# EAGLE design BarGraphDriver (EAGLE 7.5.0)
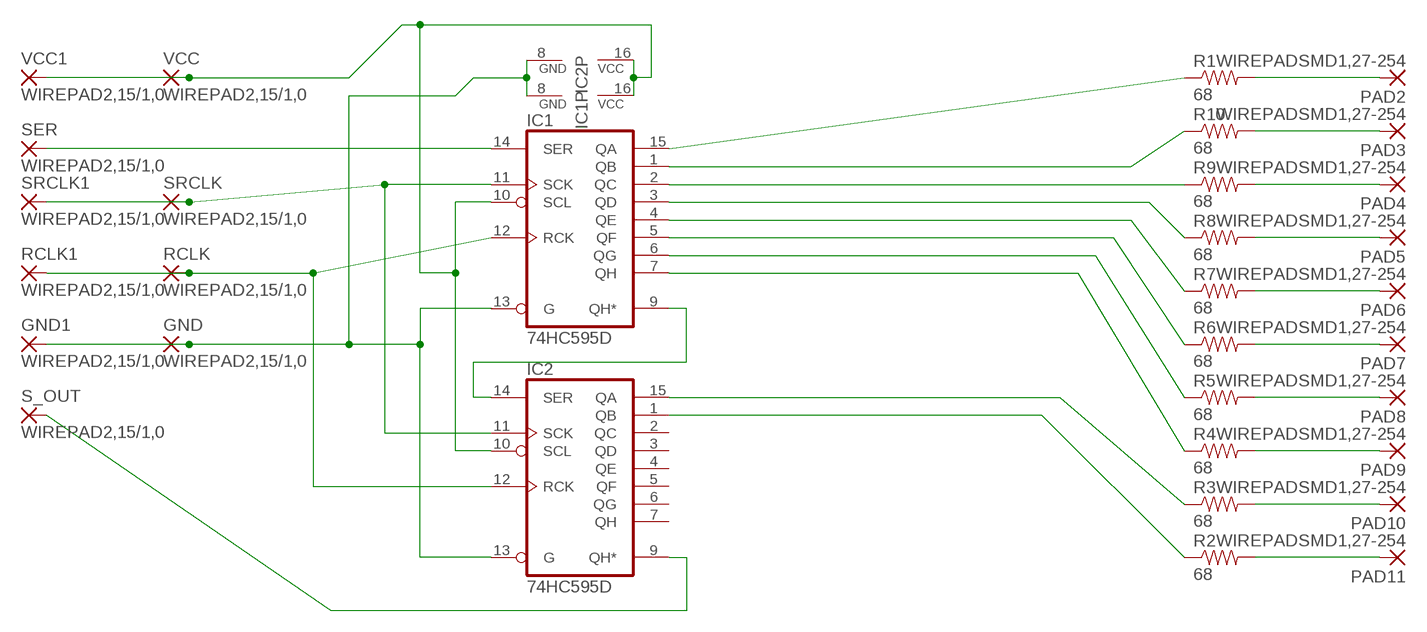
[diagram p0: schematic, sheet 1]

## Parts
GND  WIREPAD2,15/1,0  [2,15/1,0]
GND1  WIREPAD2,15/1,0  [2,15/1,0]
IC1  74HC595D  [SO16]
IC2  74HC595D  [SO16]
PAD2  WIREPADSMD1,27-254  [SMD1,27-2,54]
PAD3  WIREPADSMD1,27-254  [SMD1,27-2,54]
PAD4  WIREPADSMD1,27-254  [SMD1,27-2,54]
PAD5  WIREPADSMD1,27-254  [SMD1,27-2,54]
PAD6  WIREPADSMD1,27-254  [SMD1,27-2,54]
PAD7  WIREPADSMD1,27-254  [SMD1,27-2,54]
PAD8  WIREPADSMD1,27-254  [SMD1,27-2,54]
PAD9  WIREPADSMD1,27-254  [SMD1,27-2,54]
PAD10  WIREPADSMD1,27-254  [SMD1,27-2,54]
PAD11  WIREPADSMD1,27-254  [SMD1,27-2,54]
R1  68  RESISTOR1206  [1206]
R2  68  RESISTOR1206  [1206]
R3  68  RESISTOR1206  [1206]
R4  68  RESISTOR1206  [1206]
R5  68  RESISTOR1206  [1206]
R6  68  RESISTOR1206  [1206]
R7  68  RESISTOR1206  [1206]
R8  68  RESISTOR1206  [1206]
R9  68  RESISTOR1206  [1206]
R10  68  RESISTOR1206  [1206]
RCLK  WIREPAD2,15/1,0  [2,15/1,0]
RCLK1  WIREPAD2,15/1,0  [2,15/1,0]
S_OUT  WIREPAD2,15/1,0  [2,15/1,0]
SER  WIREPAD2,15/1,0  [2,15/1,0]
SRCLK  WIREPAD2,15/1,0  [2,15/1,0]
SRCLK1  WIREPAD2,15/1,0  [2,15/1,0]
VCC  WIREPAD2,15/1,0  [2,15/1,0]
VCC1  WIREPAD2,15/1,0  [2,15/1,0]

## Nets
GND [GND]: GND1.1(P) GND.1(P) IC1.8(GND) IC1.13(G) IC2.8(GND) IC2.13(G)
N$1 [LED]: PAD11.1(P) R2.2
N$2 [LED]: PAD10.1(P) R3.2
N$3 [LED]: PAD9.1(P) R4.2
N$4 [LED]: PAD8.1(P) R5.2
N$5 [LED]: PAD7.1(P) R6.2
N$6 [LED]: PAD6.1(P) R7.2
N$7 [LED]: PAD5.1(P) R8.2
N$8 [LED]: PAD4.1(P) R9.2
N$9 [LED]: PAD3.1(P) R10.2
N$10 [LED]: PAD2.1(P) R1.2
N$11 [LED]: IC1.15(QA) R1.1
N$12 [LED]: IC1.1(QB) R10.1
N$13 [LED]: IC1.2(QC) R9.1
N$14 [LED]: IC1.3(QD) R8.1
N$15 [LED]: IC1.4(QE) R7.1
N$16 [LED]: IC1.5(QF) R6.1
N$17 [LED]: IC1.6(QG) R5.1
N$18 [LED]: IC1.7(QH) R4.1
N$19 [LED]: IC2.15(QA) R3.1
N$20 [LED]: IC2.1(QB) R2.1
N$22: IC1.9(QH*) IC2.14(SER)
RCLK: IC1.12(RCK) IC2.12(RCK) RCLK1.1(P) RCLK.1(P)
S_OUT: IC2.9(QH*) S_OUT.1(P)
SER: IC1.14(SER) SER.1(P)
SRCLK: IC1.11(SCK) IC2.11(SCK) SRCLK1.1(P) SRCLK.1(P)
VCC [VCC]: IC1.10(SCL) IC1.16(VCC) IC2.10(SCL) IC2.16(VCC) VCC1.1(P) VCC.1(P)
Unconnected: IC2.2(QC) IC2.3(QD) IC2.4(QE) IC2.5(QF) IC2.6(QG) IC2.7(QH)

## Library data of the parts
GND GND1 PAD2-PAD11 RCLK RCLK1 S_OUT SER SRCLK SRCLK1 = wirepad:WIREPAD: Wire PAD connect wire on PCB
IC1 IC2 = 74xx-eu:74*595: 8-bit SHIFT REGISTER, output latch
R1-R10 = SparkFun-Resistors:RESISTOR: Resistor Basic schematic elements and footprints for 0603, 1206, and PTH resistors.
VCC VCC1 = smallWirepadSquare:WIREPAD: Wire PAD connect wire on PCB

## Net classes
0 default: width 0.406 mm, drill 0.381 mm, clearance 0.305 mm
1 VCC: width 0.406 mm, drill 0.381 mm, clearance 0.305 mm
2 LED: width 0.406 mm, drill 0.381 mm, clearance 0.305 mm
3 GND: width 0.406 mm, drill 0.381 mm, clearance 0.305 mm

## Board
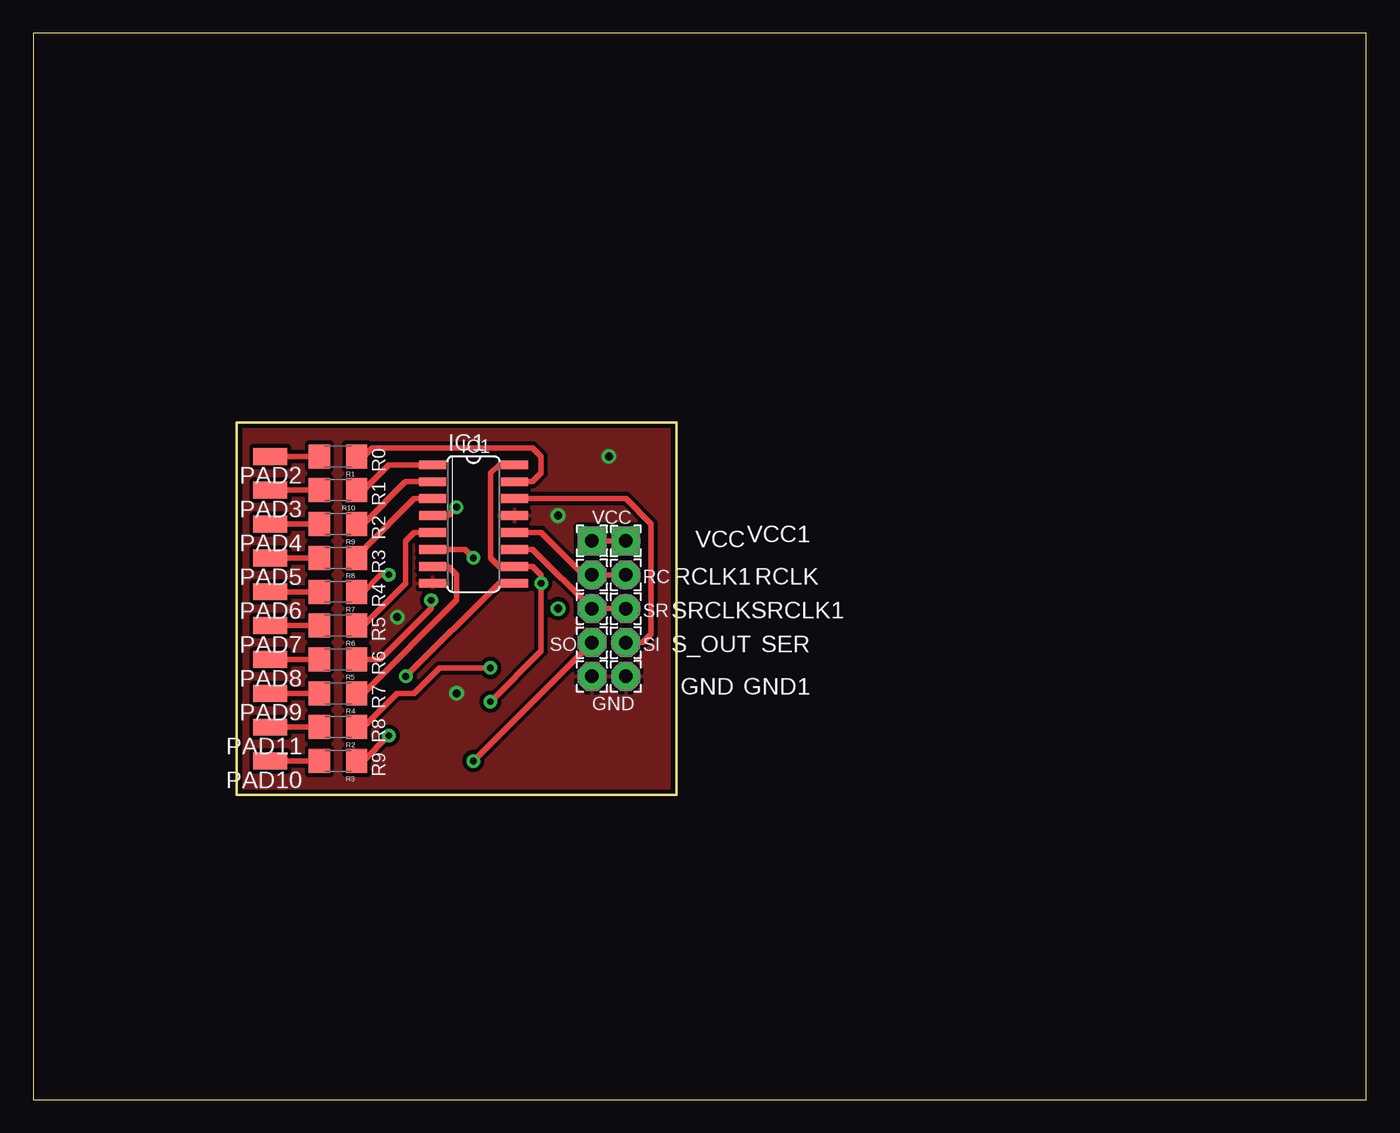
[diagram p1: board, top side]
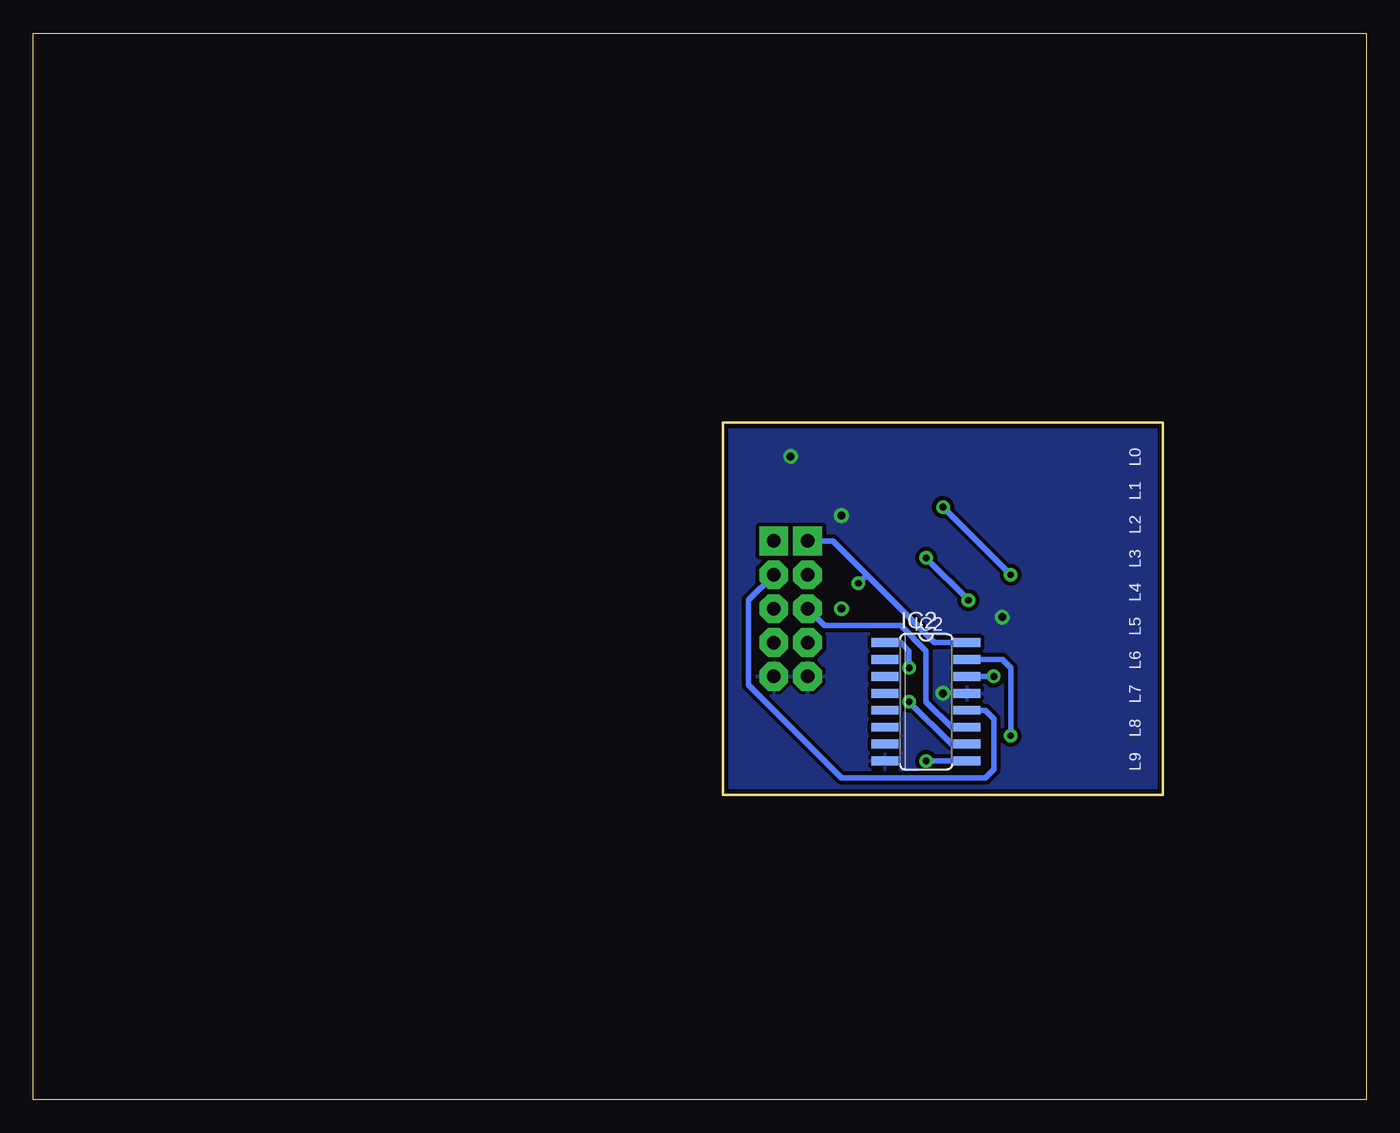
[diagram p2: board, bottom side, seen from below]

Size 100 x 80 mm. Coordinates in mm from the lower left corner, seen from the top.
Outline: 0,0 100,0 100,80 0,80 0,0
Outline: 15.24,50.8 15.24,22.86 48.26,22.86 48.26,50.8 15.24,50.8
Copper layers (1*16): Top 0.035mm / dielectric 1.5mm / Bottom 0.035mm
Design rules "SparkFun-2-layer-STANDARD": minimum track width 10mil, minimum drill 20mil, track to track 10mil, track to pad 8mil, pad to pad 8mil, via to via 10mil, smd to smd 8mil, copper to edge 8mil, drill to drill 8mil, minimum pad ring 10mil, minimum via ring 10mil, stop-mask expansion 4mil, vias tented up to drill 25mil, thermal gap 10mil

### Footprints (pad centres in the part's own frame; a part is rotated, then mirrored left to right if it is on the bottom)
2,15/1,0 = drill 1.016 pad 2.159 octagon: 1 0,0
SO16 = smd 0.66 x 2.032: 1 -4.445,-3.073; 2 -3.175,-3.073; 3 -1.905,-3.073; 4 -0.635,-3.073; 5 0.635,-3.073; 6 1.905,-3.073; 7 3.175,-3.073; 8 4.445,-3.073; 9 4.445,3.073; 10 3.175,3.073; 11 1.905,3.073; 12 0.635,3.073; 13 -0.635,3.073; 14 -1.905,3.073; 15 -3.175,3.073; 16 -4.445,3.073
SMD1,27-2,54 = smd 1.27 x 2.54: 1 0,0
1206 = smd 1.6 x 1.8: 1 -1.4,0; 2 1.4,0
2,15/1,0' = drill 1.016 pad 2.159 square: 1 0,0

### Placement (x,y rotation side)
GND  41.91,31.75 180 top
GND1  44.45,31.75 180 top
IC1  33.02,43.18 270 top
IC2  33.02,29.84 270 bottom
PAD2  17.78,48.26 90 top
PAD3  17.78,45.72 90 top
PAD4  17.78,43.18 90 top
PAD5  17.78,40.64 90 top
PAD6  17.78,38.1 90 top
PAD7  17.78,35.56 90 top
PAD8  17.78,33.02 90 top
PAD9  17.78,30.48 90 top
PAD10  17.78,25.4 90 top
PAD11  17.78,27.94 90 top
R1  22.86,48.26 180 top
R2  22.86,27.94 180 top
R3  22.86,25.4 180 top
R4  22.86,30.48 180 top
R5  22.86,33.02 180 top
R6  22.86,35.56 180 top
R7  22.86,38.1 180 top
R8  22.86,40.64 180 top
R9  22.86,43.18 180 top
R10  22.86,45.72 180 top
RCLK  44.45,39.37 180 top
RCLK1  41.91,39.37 180 top
S_OUT  41.91,34.29 180 top
SER  44.45,34.29 180 top
SRCLK  41.91,36.83 180 top
SRCLK1  44.45,36.83 180 top
VCC  WIREPAD2,15/1,0  [2,15/1,0']  41.91,41.91 0 top
VCC1  WIREPAD2,15/1,0  [2,15/1,0']  44.45,41.91 180 top

### Tracks (layer width: path | path; a pad name or v marks a point on that pad's centre or on a via)
GND  (via drill 0.6)
  other vias: 43.18,48.26 31.75,30.48 39.37,43.81 27.3,36.2
  pour Top (isolate 0.305): 15.24,50.8 15.24,22.86 48.26,22.86 48.26,50.8
  pour Bottom (isolate 0.305): 15.24,50.8 15.24,22.86 48.26,22.86 48.26,50.8
N$1
  Top 0.406: PAD11.1 R2.2
N$2
  Top 0.406: PAD10.1 R3.2
N$3
  Top 0.406: PAD9.1 R4.2
N$4
  Top 0.406: PAD8.1 R5.2
N$5
  Top 0.406: PAD7.1 R6.2
N$6
  Top 0.406: PAD6.1 R7.2
N$7
  Top 0.406: PAD5.1 R8.2
N$8
  Top 0.406: PAD4.1 R9.2
N$9
  Top 0.406: PAD3.1 R10.2
N$10
  Top 0.406: PAD2.1 R1.2
N$11
  Top 0.406: R1.1 24.77,48.26 25.4,48.9 37.47,48.9 38.1,48.26 38.1,46.99 37.47,46.35 IC1.15
N$12
  Top 0.406: IC1.1 26.67,47.62 24.77,45.72 R10.1
N$13
  Top 0.406: IC1.2 27.94,46.35 24.77,43.18 R9.1
N$14
  Top 0.406: R8.1 24.77,40.64 24.77,41.27 28.57,45.09 IC1.3
N$15  (via drill 0.51)
  Top 0.406: v26.67,39.37 26.04,39.37 24.77,38.1 R7.1 | v31.75,44.45 31.11,43.81 IC1.4
  Bottom 0.406: v31.75,44.45 v26.67,39.37
N$16
  Top 0.406: IC1.5 28.57,42.55 27.94,41.91 27.94,38.73 24.13,34.92 24.13,35.43 R6.1
N$17  (via drill 0.51)
  Top 0.406: v33.02,40.64 32.38,41.27 IC1.6 | R5.1 26.04,33.02 29.84,36.83 v29.84,37.47
  Bottom 0.406: v33.02,40.64 v29.84,37.47
N$18
  Top 0.406: R4.1 24.77,30.48 31.75,37.47 31.75,39.37 31.11,40.01 IC1.7
N$19  (via drill 0.51)
  Top 0.406: v26.67,27.3 24.77,25.4 R3.1
  Bottom 0.406: v26.67,27.3 26.67,32.38 27.3,33.02 IC2.15
N$20  (via drill 0.51)
  Top 0.406: R2.1 24.77,27.94 27.3,30.48 28.57,30.48 30.48,32.38 v34.29,32.38
  Bottom 0.406: v34.29,32.38 34.29,33.66 34.92,34.29 IC2.1
N$22  (via drill 0.51)
  Top 0.406: v27.94,31.75 34.92,38.73 IC1.9
  Bottom 0.406: v27.94,31.75 IC2.14
RCLK
  Top 0.406: IC1.12 38.1,42.55 41.27,39.37 RCLK1.1 RCLK.1
  Bottom 0.406: IC2.12 28.57,29.21 27.94,28.57 27.94,24.77 28.57,24.13 39.37,24.13 46.35,31.11 46.35,37.47 RCLK.1
S$1  (via drill 0.6)
  other vias: 39.37,36.83
S_OUT  (via drill 0.51)
  Top 0.406: S_OUT.1 v33.02,25.4
  Bottom 0.406: v33.02,25.4 IC2.9
SER
  Top 0.406: IC1.14 44.45,45.09 46.35,43.18 46.35,34.92 45.72,34.29 SER.1
SRCLK
  Top 0.406: IC1.11 37.47,41.27 SRCLK.1 SRCLK1.1
  Bottom 0.406: IC2.11 31.11,27.94 33.02,29.84 33.02,33.66 34.92,35.56 40.64,35.56 SRCLK.1
VCC  (via drill 0.51)
  Top 0.406: VCC.1 VCC1.1 | v34.29,29.84 38.1,33.66 v38.1,38.73 38.1,39.37 37.47,40.01 IC1.10 34.92,40.01 34.29,40.64 34.29,46.99 34.92,47.62 IC1.16
  Bottom 0.406: IC2.16 32.38,34.29 37.47,39.37 | 37.47,39.37 40.01,41.91 VCC.1 | IC2.10 31.11,26.67 v34.29,29.84 | v38.1,38.73 37.47,39.37

### Text on the board
tPlace: IC1 | R0 | R1 | R2 | VCC | R3 | R4 | RC | R5 | SR | R6 | SO | SI | R7 | R8 | GND | R9
bPlace: L0 | L1 | L2 | L3 | L4 | L5 | IC2 | L6 | L7 | L8 | L9